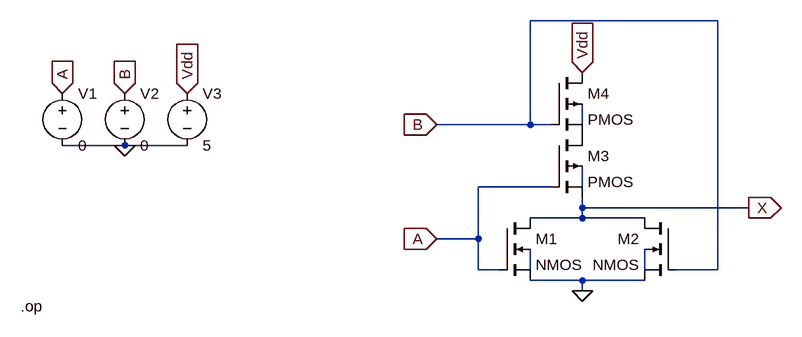
[diagram p0: schematic nor_gate.asc]
nor_gate.asc, the LTspice schematic file:
Version 4.1
SHEET 1 880 680
WIRE 480 -160 192 -160
WIRE 192 0 192 -160
WIRE 192 0 48 0
WIRE 224 0 192 0
WIRE 272 0 272 -32
WIRE -432 32 -528 32
WIRE -336 32 -432 32
WIRE 224 96 112 96
WIRE 272 96 272 64
WIRE 272 128 272 112
WIRE 528 128 272 128
WIRE 272 144 272 128
WIRE 272 144 192 144
WIRE 368 144 272 144
WIRE 112 176 112 96
WIRE 112 176 48 176
WIRE 112 224 112 176
WIRE 144 224 112 224
WIRE 192 224 192 192
WIRE 368 224 368 192
WIRE 480 224 480 -160
WIRE 480 224 416 224
WIRE 272 240 192 240
WIRE 368 240 272 240
WIRE 272 256 272 240
FLAG 272 256 0
FLAG 272 -80 Vdd
IOPIN 272 -80 In
FLAG 48 176 A
IOPIN 48 176 In
FLAG 48 0 B
IOPIN 48 0 In
FLAG 528 128 X
IOPIN 528 128 Out
FLAG -528 -48 A
IOPIN -528 -48 In
FLAG -432 -48 B
IOPIN -432 -48 In
FLAG -336 -48 Vdd
IOPIN -336 -48 In
FLAG -432 32 0
SYMBOL nmos4 144 144 R0
SYMATTR InstName M1
SYMBOL nmos4 416 144 M0
SYMATTR InstName M2
SYMBOL pmos4 224 16 R0
SYMATTR InstName M3
SYMBOL pmos4 224 -80 R0
SYMATTR InstName M4
SYMBOL voltage -528 -64 R0
WINDOW 123 0 0 Left 0
WINDOW 39 0 0 Left 0
SYMATTR InstName V1
SYMATTR Value 0
SYMBOL voltage -432 -64 R0
WINDOW 123 0 0 Left 0
WINDOW 39 0 0 Left 0
SYMATTR InstName V2
SYMATTR Value 0
SYMBOL voltage -336 -64 R0
WINDOW 123 0 0 Left 0
WINDOW 39 0 0 Left 0
SYMATTR InstName V3
SYMATTR Value 5
TEXT -592 280 Left 2 !.op

The netlist it stands for:
* nor_gate.asc
M1 X A 0 N003 NMOS
M2 X B 0 N004 NMOS
M3 P001 A X N002 PMOS
M4 Vdd B P001 N001 PMOS
V1 A 0 0
V2 B 0 0
V3 Vdd 0 5
.model NMOS NMOS
.model PMOS PMOS
.lib standard.mos
.op
.backanno
.end